# Altium schematic sheet LIDO-HW.001.CoverPage.SchDoc
size A3; CompanyName: EST-Floattech; DrawnBy: RR; Organization: EST-Floattech; Address2: Zandsteen 1; Address3: 2132 MZ; Address4: Hoofddorp; DocumentNumber: 21xxx; Revision: 1.0; SheetNumber: 1; SheetTotal: 17
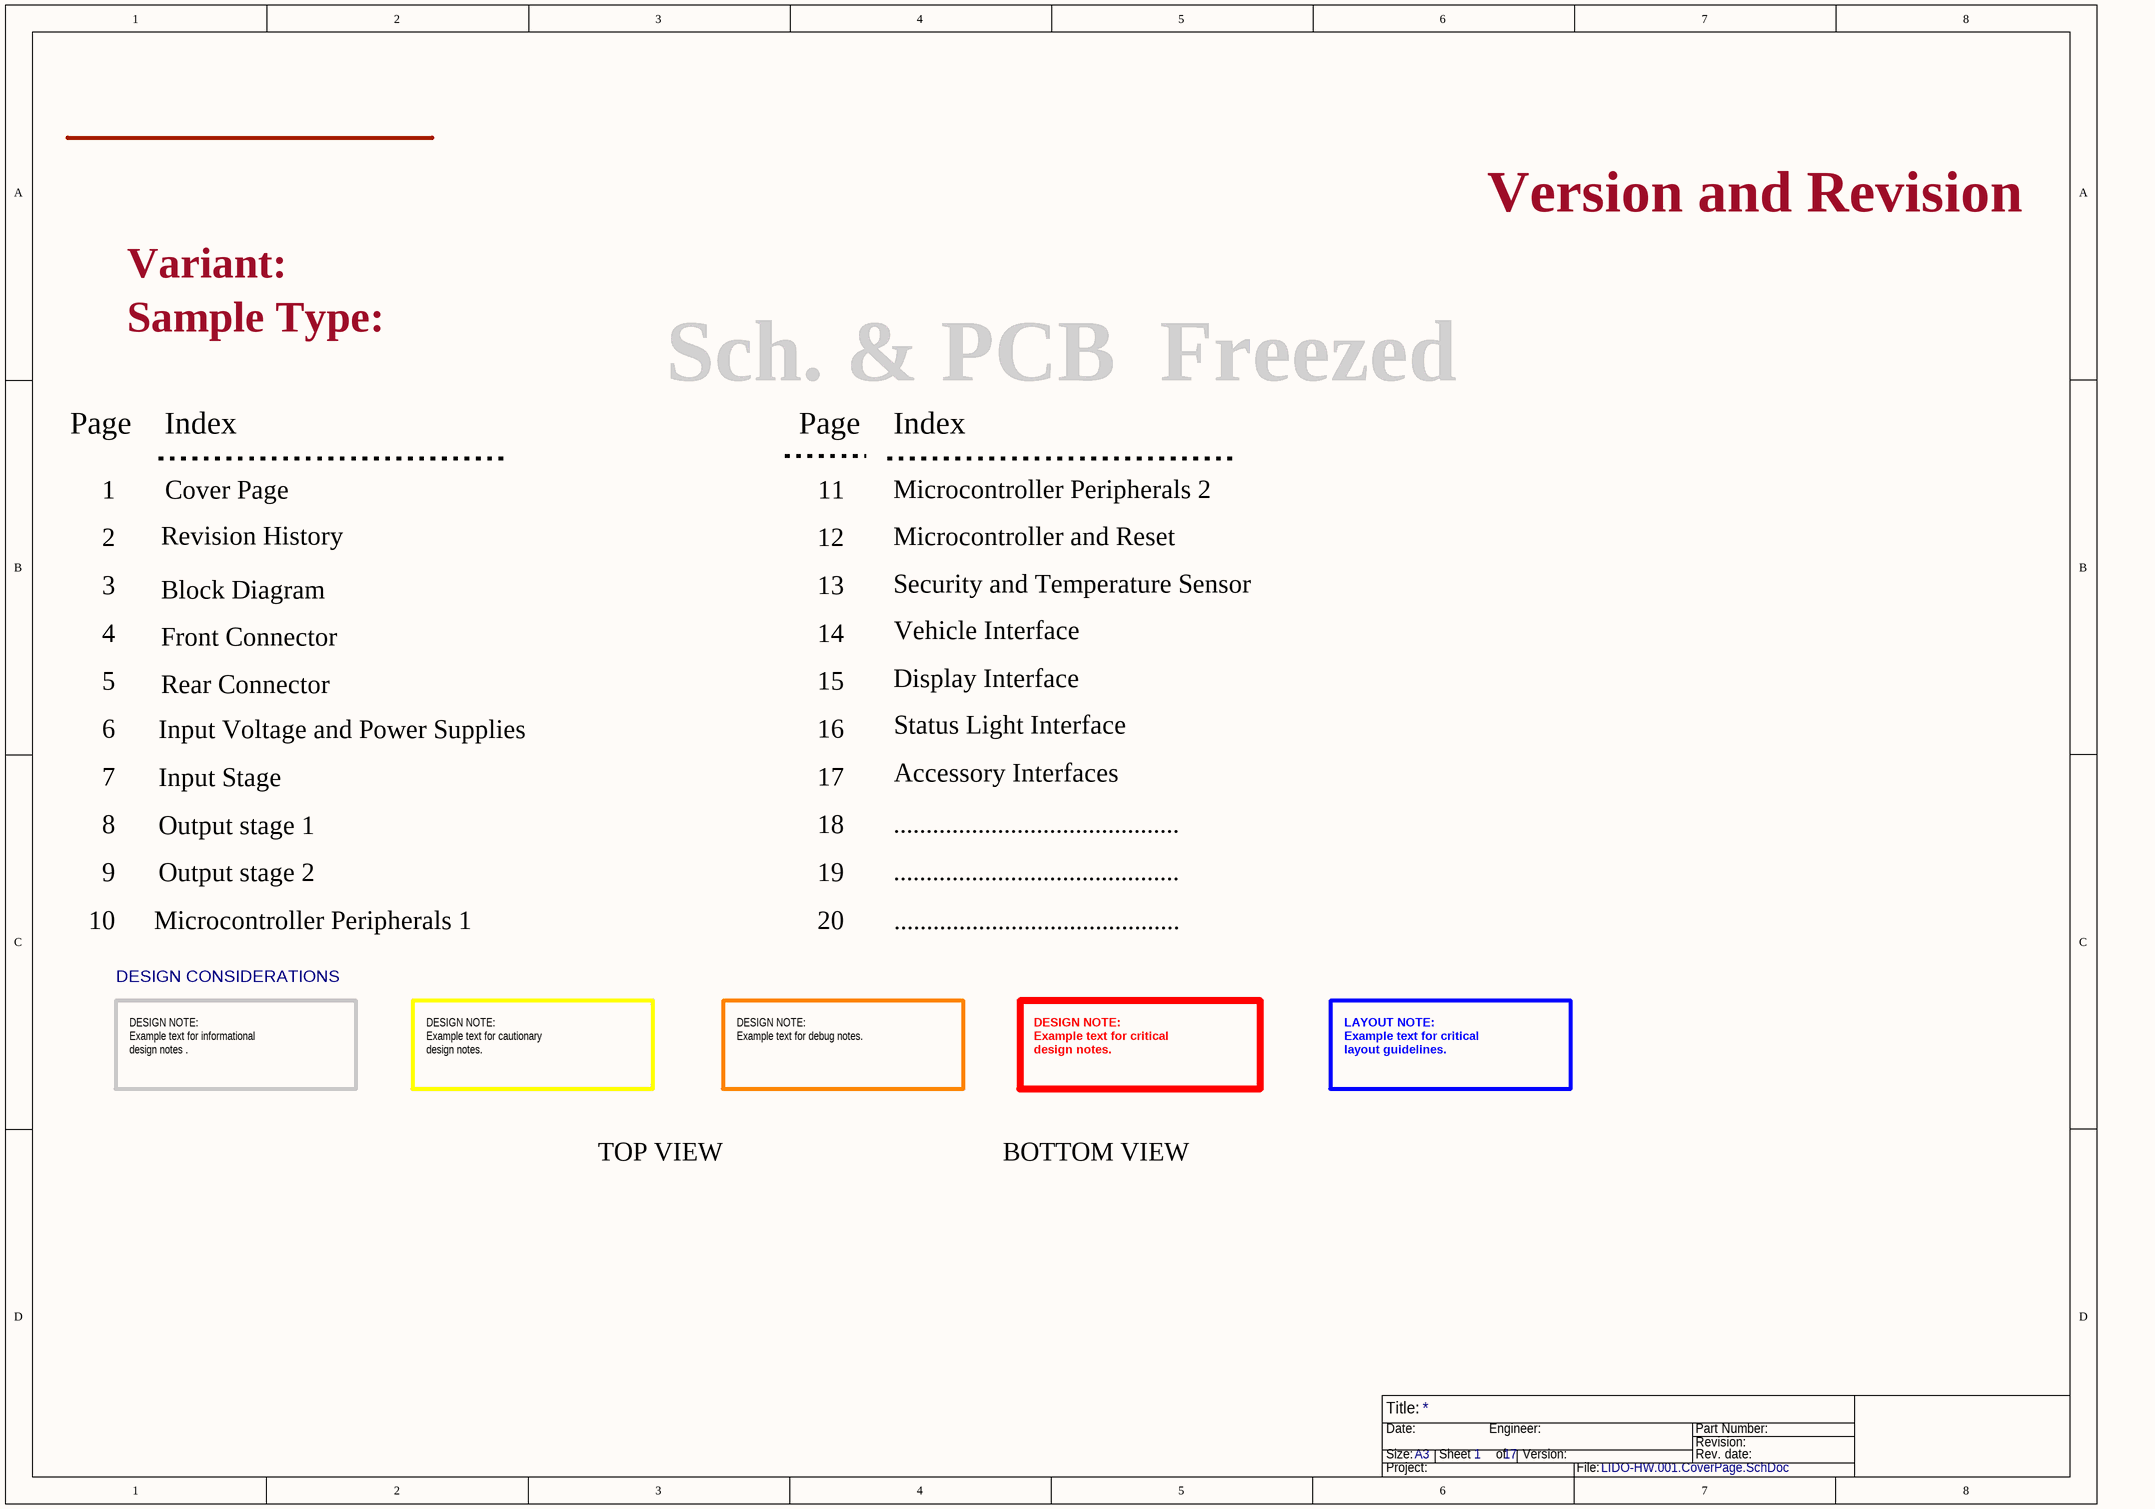
[diagram p0: LIDO-HW.001.CoverPage.SchDoc]

## Notes on the sheet
- Version and Revision
- Variant:
- Sample Type:
- Page
- Index
- Sch. & PCB  Freezed
- 1
- Cover Page
- 11
- Microcontroller Peripherals 2
- 2
- Revision History
- 12
- Microcontroller and Reset
- 3
- 4
- Block Diagram
- Front Connector
- 13
- 14
- Security and Temperature Sensor
- Vehicle Interface
- 5
- Rear Connector
- 15
- Display Interface
- 6
- 7
- Input Voltage and Power Supplies
- Input Stage
- 16
- 17
- Status Light Interface
- Accessory Interfaces
- 8
- Output stage 1
- 18
- ............................................
- 9
- Output stage 2
- 19
- DESIGN CONSIDERATIONS
- 10
- Microcontroller Peripherals 1
- 20
- DESIGN NOTE:
  Example text for informational
  design notes .
- DESIGN NOTE:
  Example text for cautionary
  design notes.
- DESIGN NOTE:
  Example text for debug notes.
- DESIGN NOTE:
  Example text for critical
  design notes.
- LAYOUT NOTE:
  Example text for critical
  layout guidelines.
- TOP VIEW
- BOTTOM VIEW
- Title:
- Size:
- Date:
- A3
- Sheet       of
- Engineer:
- Version:
- Part Number:
- Revision:
- Rev. date:
- Project:
- File: